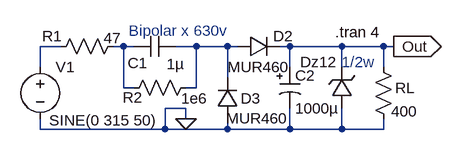
[diagram p0: schematic SinTrafo.asc]
SinTrafo.asc, the LTspice schematic file:
Version 4
SHEET 1 880 680
WIRE -48 240 -80 240
WIRE 48 240 32 240
WIRE 64 240 48 240
WIRE 160 240 128 240
WIRE 208 240 160 240
WIRE 224 240 208 240
WIRE 304 240 288 240
WIRE 384 240 304 240
WIRE 448 240 384 240
WIRE 464 240 448 240
WIRE -80 272 -80 240
WIRE 304 272 304 240
WIRE 384 272 384 240
WIRE 448 272 448 240
WIRE 208 288 208 240
WIRE 48 304 48 240
WIRE 64 304 48 304
WIRE 160 304 160 240
WIRE 160 304 144 304
WIRE 144 336 112 336
WIRE 144 352 144 336
WIRE -80 368 -80 352
WIRE 112 368 112 336
WIRE 112 368 -80 368
WIRE 208 368 208 352
WIRE 208 368 112 368
WIRE 304 368 304 336
WIRE 304 368 208 368
WIRE 384 368 384 336
WIRE 384 368 304 368
WIRE 448 368 448 352
WIRE 448 368 384 368
FLAG 144 352 0
FLAG 464 240 Out
IOPIN 464 240 Out
SYMBOL voltage -80 256 R0
WINDOW 3 14 98 Left 0
WINDOW 123 0 0 Left 0
WINDOW 39 0 0 Left 0
SYMATTR InstName V1
SYMATTR Value SINE(0 315 50)
SYMBOL Miscel\\zener 400 336 R180
WINDOW 0 24 72 Left 0
WINDOW 3 -35 -20 Invisible 0
SYMATTR InstName Dz12
SYMATTR Value BZX84C12L
SYMBOL diode 224 256 R270
WINDOW 0 16 70 VTop 0
WINDOW 3 0 32 VBottom 0
SYMATTR InstName D2
SYMATTR Value MUR460
SYMBOL diode 224 352 R180
WINDOW 0 -35 32 Left 0
WINDOW 3 -77 1 Left 0
SYMATTR InstName D3
SYMATTR Value MUR460
SYMBOL res -64 256 R270
WINDOW 0 16 2 VTop 0
WINDOW 3 44 95 VBottom 0
SYMATTR InstName R1
SYMATTR Value 47
SYMBOL cap 128 224 R90
WINDOW 0 57 58 VBottom 0
WINDOW 3 28 0 VTop 0
SYMATTR InstName C1
SYMATTR Value 1µ
SYMBOL res 160 288 R90
WINDOW 0 46 98 VBottom 0
WINDOW 3 17 3 VTop 0
SYMATTR InstName R2
SYMATTR Value 1e6
SYMBOL polcap 288 272 R0
WINDOW 0 24 13 Left 0
WINDOW 3 24 64 Left 0
SYMATTR InstName C2
SYMATTR Value 1000µ
SYMATTR Description Capacitor
SYMATTR Type cap
SYMATTR SpiceLine V=16 Irms=1.41 Rser=0.047 MTBF=5000 Lser=0 mfg="Nichicon" pn="UPL1C102MPH" type="Al electrolytic" ppPkg=1
SYMBOL res 432 256 R0
WINDOW 0 34 48 Left 0
WINDOW 3 28 84 Left 0
SYMATTR InstName RL
SYMATTR Value 400
TEXT 374 218 Left 0 !.tran 4
TEXT 56 216 Left 0 ;Bipolar x 630v
TEXT 384 264 Left 0 ;1/2w

The netlist it stands for:
* SinTrafo.asc
V1 N001 0 SINE(0 315 50)
Dz12 0 Out BZX84C12L
D2 N003 Out MUR460
D3 0 N003 MUR460
R1 N001 N002 47
C1 N003 N002 1µ
R2 N003 N002 1e6
C2 Out 0 1000µ V=16 Irms=1.41 Rser=0.047 MTBF=5000 Lser=0 mfg="Nichicon" pn="UPL1C102MPH" type="Al electrolytic" ppPkg=1
RL Out 0 400
.model D D
.lib standard.dio
.tran 4
* Bipolar x 630v
* 1/2w
.backanno
.end